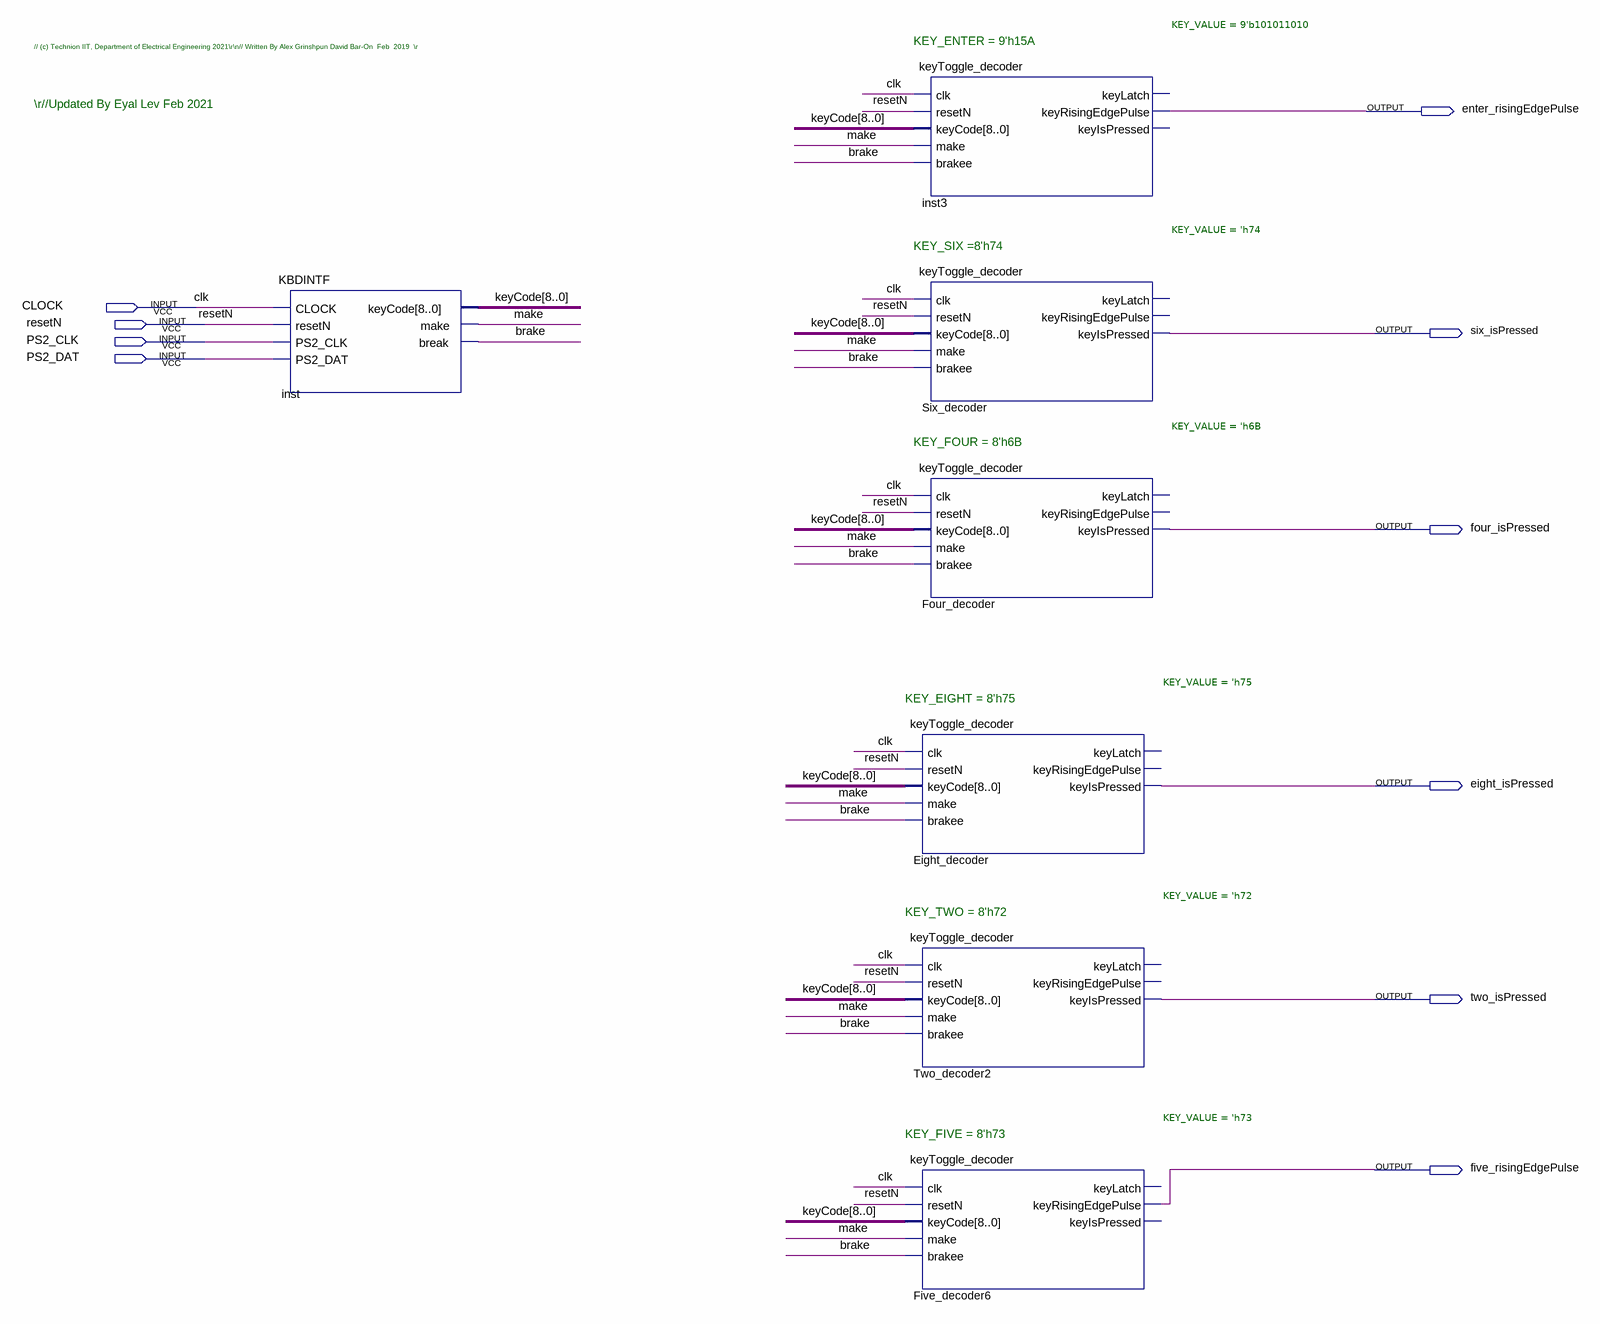
[diagram p0: schematic sheet]
// Quartus schematic KEYBOARD_INTERFACE.bdf as structural Verilog: 7 symbols, 10 pins
module KEYBOARD_INTERFACE (
  input  CLOCK,
  input  resetN,
  input  PS2_CLK,
  input  PS2_DAT,
  output enter_risingEdgePulse,
  output six_isPressed,
  output four_isPressed,
  output eight_isPressed,
  output two_isPressed,
  output five_risingEdgePulse
);

  wire brake, make;
  wire [8:0] keyCode;

  KBDINTF inst (
    .CLOCK(CLOCK), .resetN(resetN), .PS2_CLK(PS2_CLK), .PS2_DAT(PS2_DAT), .keyCode(keyCode), .make(make),
    .\break (brake));
  keyToggle_decoder #(.KEY_VALUE(9'b101011010)) inst3 (
    .clk(CLOCK), .resetN(resetN), .keyCode(keyCode), .make(make), .brakee(brake),
    .keyRisingEdgePulse(enter_risingEdgePulse));  // open: keyLatch, keyIsPressed
  keyToggle_decoder #(.KEY_VALUE('h74)) Six_decoder (
    .clk(CLOCK), .resetN(resetN), .keyCode(keyCode), .make(make), .brakee(brake), .keyIsPressed(six_isPressed));  // open: keyLatch, keyRisingEdgePulse
  keyToggle_decoder #(.KEY_VALUE('h6B)) Four_decoder (
    .clk(CLOCK), .resetN(resetN), .keyCode(keyCode), .make(make), .brakee(brake),
    .keyIsPressed(four_isPressed));  // open: keyLatch, keyRisingEdgePulse
  keyToggle_decoder #(.KEY_VALUE('h75)) Eight_decoder (
    .clk(CLOCK), .resetN(resetN), .keyCode(keyCode), .make(make), .brakee(brake),
    .keyIsPressed(eight_isPressed));  // open: keyLatch, keyRisingEdgePulse
  keyToggle_decoder #(.KEY_VALUE('h72)) Two_decoder2 (
    .clk(CLOCK), .resetN(resetN), .keyCode(keyCode), .make(make), .brakee(brake), .keyIsPressed(two_isPressed));  // open: keyLatch, keyRisingEdgePulse
  keyToggle_decoder #(.KEY_VALUE('h73)) Five_decoder6 (
    .clk(CLOCK), .resetN(resetN), .keyCode(keyCode), .make(make), .brakee(brake),
    .keyRisingEdgePulse(five_risingEdgePulse));  // open: keyLatch, keyIsPressed

  // Other names for the same wires on the sheet: clk = CLOCK

  // Notes on the sheet:
  //   KEY_ENTER = 9'h15A
  //   // (c) Technion IIT, Department of Electrical Engineering 2021\r\n// Written By Alex Grinshpun David Bar-On  Feb  2019  \r
  //   \r//Updated By Eyal Lev Feb 2021
  //   KEY_SIX =8'h74
  //   KEY_FOUR = 8'h6B
  //   KEY_EIGHT = 8'h75
  //   KEY_TWO = 8'h72
  //   KEY_FIVE = 8'h73
endmodule
